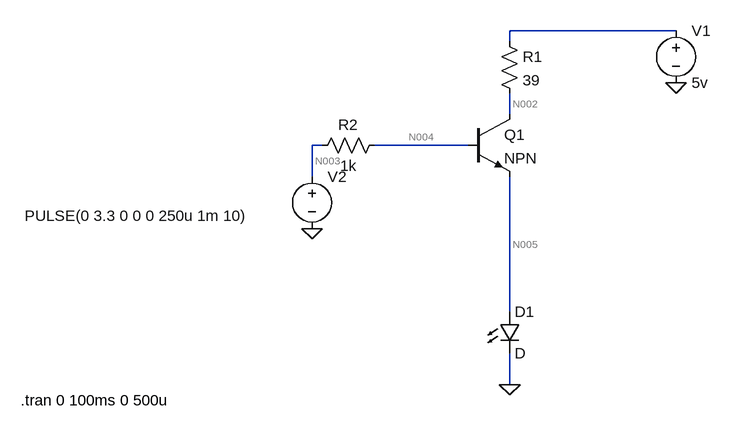
[diagram p0: schematic control_LED_3_3_to_5.asc]
control_LED_3_3_to_5.asc, the LTspice schematic file:
Version 4
SHEET 1 880 680
WIRE 464 -416 208 -416
WIRE 208 -400 208 -416
WIRE 208 -288 208 -320
WIRE -80 -240 -96 -240
WIRE 144 -240 0 -240
WIRE -96 -192 -96 -240
WIRE 208 16 208 -192
WIRE 208 128 208 80
FLAG 208 128 0
FLAG 464 -336 0
FLAG -96 -112 0
SYMBOL LED 192 16 R0
SYMATTR InstName D1
SYMBOL npn 144 -288 R0
SYMATTR InstName Q1
SYMBOL voltage 464 -432 R0
WINDOW 123 0 0 Left 0
WINDOW 39 0 0 Left 0
SYMATTR InstName V1
SYMATTR Value 5v
SYMBOL res 16 -256 R90
WINDOW 0 0 56 VBottom 2
WINDOW 3 32 56 VTop 2
SYMATTR InstName R2
SYMATTR Value 1k
SYMBOL voltage -96 -208 R0
WINDOW 3 -442 76 Left 2
WINDOW 123 0 0 Left 0
WINDOW 39 0 0 Left 0
SYMATTR Value PULSE(0 3.3 0 0 0 250u 1m 10)
SYMATTR InstName V2
SYMBOL res 192 -416 R0
SYMATTR InstName R1
SYMATTR Value 39
TEXT -544 152 Left 2 !.tran 0 100ms 0 500u

The netlist it stands for:
* control_LED_3_3_to_5.asc
D1 N005 0 D
Q1 N002 N004 N005 0 NPN
V1 N001 0 5v
R2 N004 N003 1k
V2 N003 0 PULSE(0 3.3 0 0 0 250u 1m 10)
R1 N001 N002 39
.model D D
.lib standard.dio
.model NPN NPN
.model PNP PNP
.lib standard.bjt
.tran 0 100ms 0 500u
.backanno
.end

* Results of the author's LTspice run, read from the files saved beside the schematic
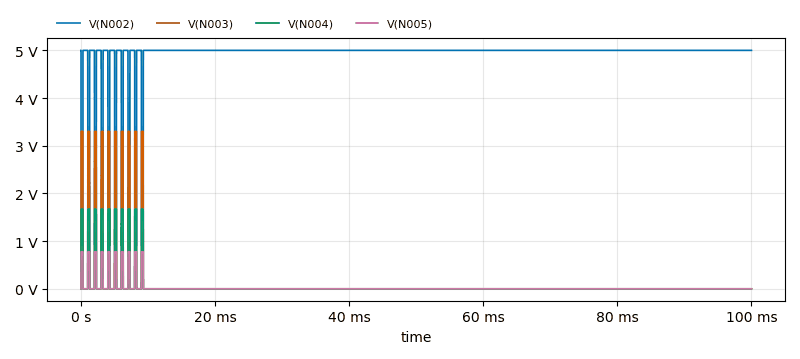
[diagram p1: Transient Analysis of control_LED_3_3_to_5.asc, plotted from the saved traces]
* Transient Analysis, 1 run:
*   V(N002): min 911 mV, max 5 V, average 4.89 V, rms 4.934 V, last 5 V
*   V(N003): min 0 V, max 3.3 V, average 90.75 mV, rms 539.7 mV, last 0 V
*   V(N004): min 0 V, max 1.671 V, average 47.35 mV, rms 278.4 mV, last 0 V
*   V(N005): min 41.83 µV, max 775.9 mV, average 21.98 mV, rms 129.2 mV, last 41.83 µV